# Altium schematic sheet USB_Interface.SchDoc
size A4; SheetNumber: 13; SheetTotal: 13
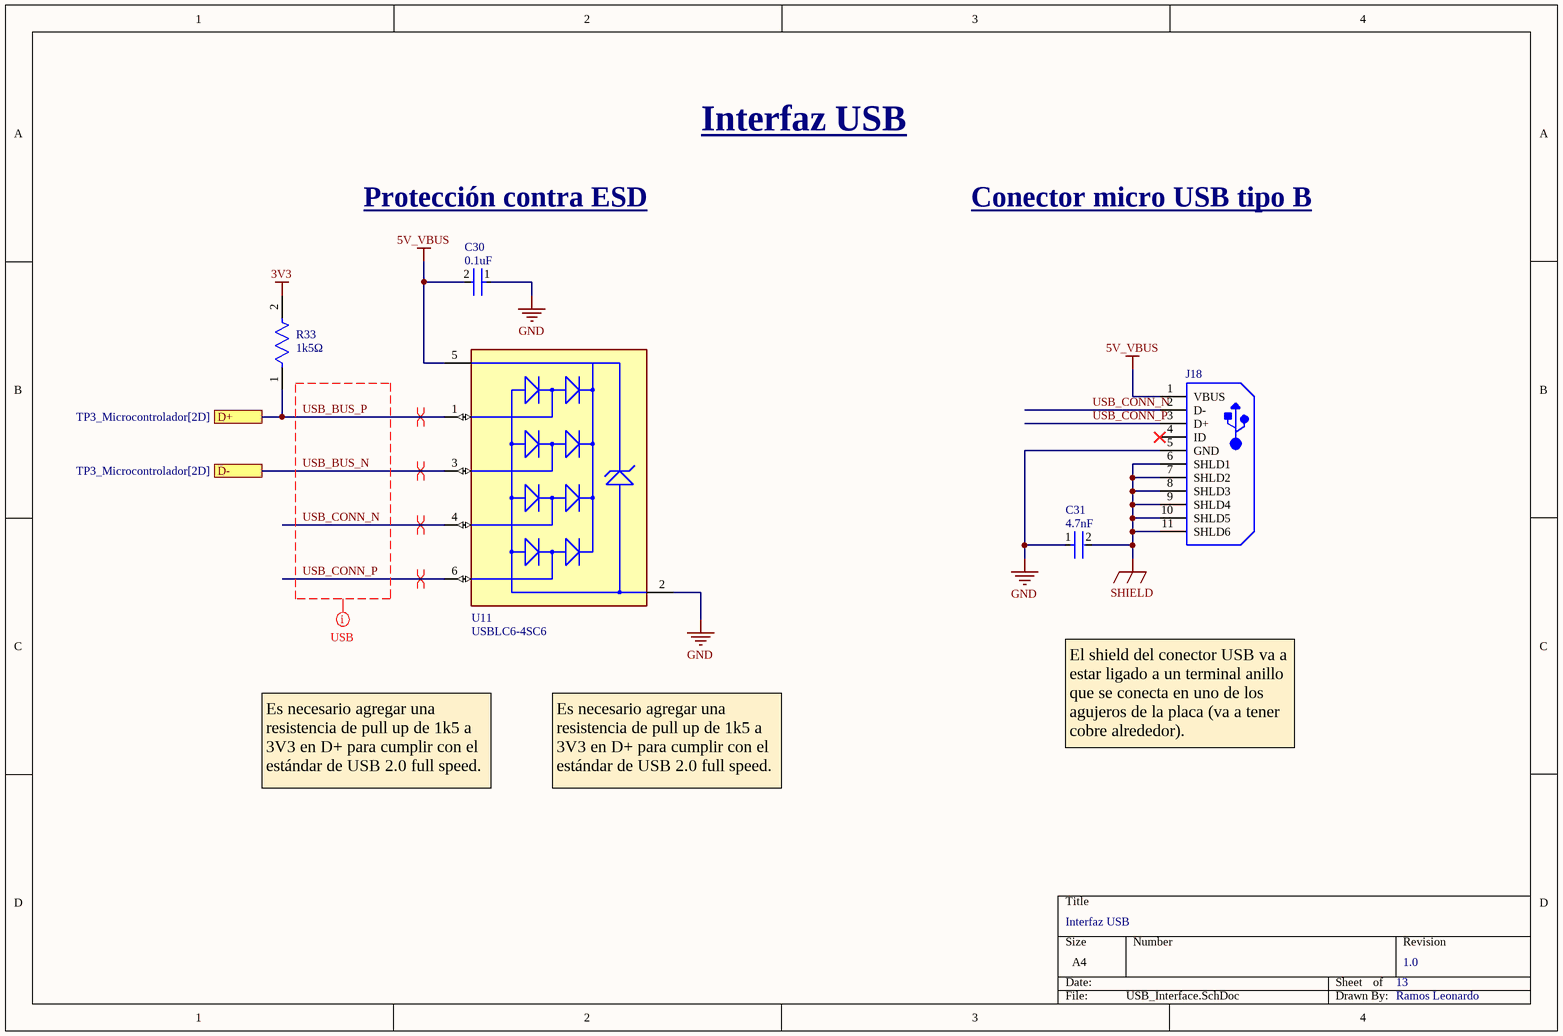
[diagram p0: USB_Interface.SchDoc]

## Parts
C30  value 0.1uF  [FP-CC0805-0_85-MFG]  (hidden comment: CC0805KRX7R8BB104)
C31  Capacitance: 4.7nF  [FP-GRM21B-0_1-IPC_B]  (hidden comment: GRM21B7U1A104JA01L)
J18  105017-0001  [USB-MICRO-B_V]  (value not drawn)
R33  Resistance: 1k5Ω  [FP-CRCW0805-e3-IPC_B]  (hidden comment: CRCW08054K70JNEA)
U11  USBLC6-4SC6  [FP-SOT23-6L-MFG]

## Ports
D+ (see TP3_Microcontrolador[2D]), D- (see TP3_Microcontrolador[2D])

## Nets
3V3: R33.2
5V_VBUS: C30.2 J18.1(VBUS) U11.5(VBUS)
GND: C30.1 C31.1 J18.5(GND) U11.2(GND)
SHIELD: C31.2 J18.6(SHLD1) J18.7(SHLD2) J18.8(SHLD3) J18.9(SHLD4) J18.10(SHLD5) J18.11(SHLD6)
USB_BUS_N: U11.3(I/O2) ; port D-
USB_BUS_P: R33.1 U11.1(I/O1) ; port D+
USB_CONN_N: J18.2(D-) U11.4(I/O3)
USB_CONN_P: J18.3(D+) U11.6(I/O4)

Not connected (* = marked no-connect by the designer): J18 4(ID)*

## Layout directives
differential pair: USB_BUS_N, USB_BUS_P, USB_CONN_N, USB_CONN_P
net class USB: USB_BUS_N, USB_BUS_P, USB_CONN_N, USB_CONN_P

## Notes on the sheet
- Interfaz USB
- Protección contra ESD
- Conector micro USB tipo B
- Es necesario agregar una resistencia de pull up de 1k5 a 3V3 en D+ para cumplir con el estándar de USB 2.0 full speed.
- El shield del conector USB va a estar ligado a un terminal anillo que se conecta en uno de los agujeros de la placa (va a tener cobre alrededor).
- 13
- 1.0
- Ramos Leonardo

## Library data of the parts
C30 = CMP-1036-04410-2: CAP CER 0.1UF 25V X7R 0805; Manufacturer: Yageo; Tolerance: 0.1; Material: Ceramic; Capacitance: 100 nF; ComponentLink2URL: http://www.yageo.com/documents/recent/UPY-GPHC_Y5V_6.3V-to-50V_8.pdf; Category: Cap; Mouser Description: Multilayer Ceramic Capacitors MLCC - SMD/SMT 100nF 25V X7R 10%; Manufacturer Part Number: CC0805KRX7R8BB104; Device Class L1: Passive Components; Footprint Url: http://www.yageo.com/exep/pages/download/literatures/UPY-C_GEN_24.pdf; Height: 0.95mm; Digikey Description: CAP CER 0.1UF 25V X7R 0805; Lead Free: Yes; Temperature Range High: +85°C; Temperature: -30°C to +85°C; Ipc Land Pattern Name: CAPC200125X85; Automotive: No; Octopart: https://octopart.com/cc0805krx7r8bb104-yageo-39467766; Device Class L2: Capacitors; Temperature Characteristic: X7R; Voltage Rating: 25 V; ComponentLink2Description: Datasheet; Temperature Range Low: -30°C; Device Class L3: Ceramic Capacitors; RoHS: TRUE; Package: CC0805-0.85
C31 = CMP-06035-037063-1: Chip Multilayer Ceramic Capacitors for General Purpose, 0805, 4.7nF, U2J, -750ppm/°C, 5%, 10V; Depth: 1.25mm; Voltage Rating (DC): 10V; Voltage Rating: 10V; Length: 2mm; Max Operating Temperature: 125°C; Thickness: 0.053inch; Dielectric: U2J; Termination: SMD/SMT; Package Quantity: 3000; Packaging: Tape and Reel; Case Code (Metric): 2012; Tolerance: 5%; Case Code (Imperial): 0805; Case/Package: 0805; Mount: Surface Mount; Width: 0.049inch; Height: 1.25mm; Radiation Hardening: No; Min Operating Temperature: -55°C
J18 = CMP-2000-05827-1: Micro-USB B Receptacle, Right Angle, Bottom Mount, Surface Mount, with Solder Tabs, -30 to 85 degC, 5-Pin USB, RoHS, Tape and Reel; Manufacturer: Molex; Featured Product: Micro-USBConnectorsUSBConnectors; Other Names: WM1399DKR; Package Version: Rev. F, 12/2012; Number of Contacts: 5; Connector Type: USB-microB; Catalog Drawings: 1050170001; 3D Model: 105017-0001.stp; Mating Products: WM17145-ND-CABLEMICROUSBBTOSTDA1.0MWM17147-ND-CABLEMICROUSBBTOSTDA2.0MWM17146-ND-CABLEMICROUSBBTOSTDA1.5M; PCN Assembly/Origin: ResinSupplier21/Oct/2015; Voltage - Max: 30V; Online Catalog: Molex-MicroUSB; Manufacturer URL: http://www.molex.com/; Package Description: 5-Leads USB, Micro B, Body 7.5 x 5 mm, Pitch 0.65 mm; Datasheet URL: http://www.molex.com/elqNow/elqRedir.htm?ref=http://www.molex.com/webdocs/datasheets/pdf/en-us/1050170001_IO_CONNECTORS.pdf; Ingress Protection: -; Datasheet Version: 03/2016; Mounting Type: BoardCutout,SurfaceMount,RightAngle; Circuits: 5; Standard Package: 1; Package Reference: MICRO-B; Package URL: http://www.molex.com/pdm_docs/sd/1050170001_sd.pdf; Category: Connectors,Interconnects; Series: -; RoHS Information: 1050170001CertofCompliance; Features: Shielded,SolderRetention; Family: USB,DVI,HDMIConnectors; Specifications: -; Gender: Receptacle; Packaging: Digi-Reel®; Mounting Technology: SurfaceMount
R33 = CMP-2001-03967-2: RES Thick Film, 5%, 0.125W, 200ppm/°C, 0805; Power Rating: 125mW; Voltage Rating: 150V; Radiation Hardening: No; Case Code (Imperial): 0805; Military Standard: Not; Contact Plating: Tin; Weight: 0.000194oz; Mount: Surface Mount; Termination: SMD/SMT; Packaging: Tape and Reel; Min Operating Temperature: -55°C; Width: 1.25mm; Tolerance: 5%; Height: 0.45mm; Depth: 1.25mm; Length: 2mm; Temperature Coefficient: 200ppm/°C; Case Code (Metric): 2012; Package Quantity: 5000; Max Operating Temperature: 155°C; Case/Package: 0805; Composition: Thick Film
U11 = CMP-2000-07370-2: TVS DIODE 5.25V 17V SOT23-6; Manufacturer: STMicroelectronics; Peak Pulse Power: 130W; Breakdown Voltage: 6V; Value: 3pF; Direction: Unidirectional; Interface: USB,Ethernet,Other; Number Of Channels: 4; Standoff Height: 0mm; Max Junction Temp: +125°C; Digikey Description: TVS DIODE 5.25V 17V SOT23-6; Automotive: No; Package: SOT23-6L; Mouser Description: USBLC6 Series 4 Line 6 V Uni / Bi-Directional ESD Protection - SOT-23-6; Octopart: https://octopart.com/usblc6-4sc6-stmicroelectronics-347147; RoHS: TRUE; ComponentLink2URL: https://upverter.com/datasheet/23dc4ffb028d868909e80577610284b194f13213.pdf; ComponentLink2Description: Datasheet; Device Class L1: Circuit Protection; Lead Free: Yes; Temperature Range High: +125°C; Device Class L2: ESD and Circuit Protection ICs; Device Class L3: unset; Capacitance: 3pF; Height: 1.45mm; Temperature Range Low: -40°C; Manufacturer Part Number: USBLC6-4SC6; Temperature: -40°C to +125°C; Category: Diode; Clamping Voltage: 17V